# Altium project Lidar_PCB_Project.PrjPcb
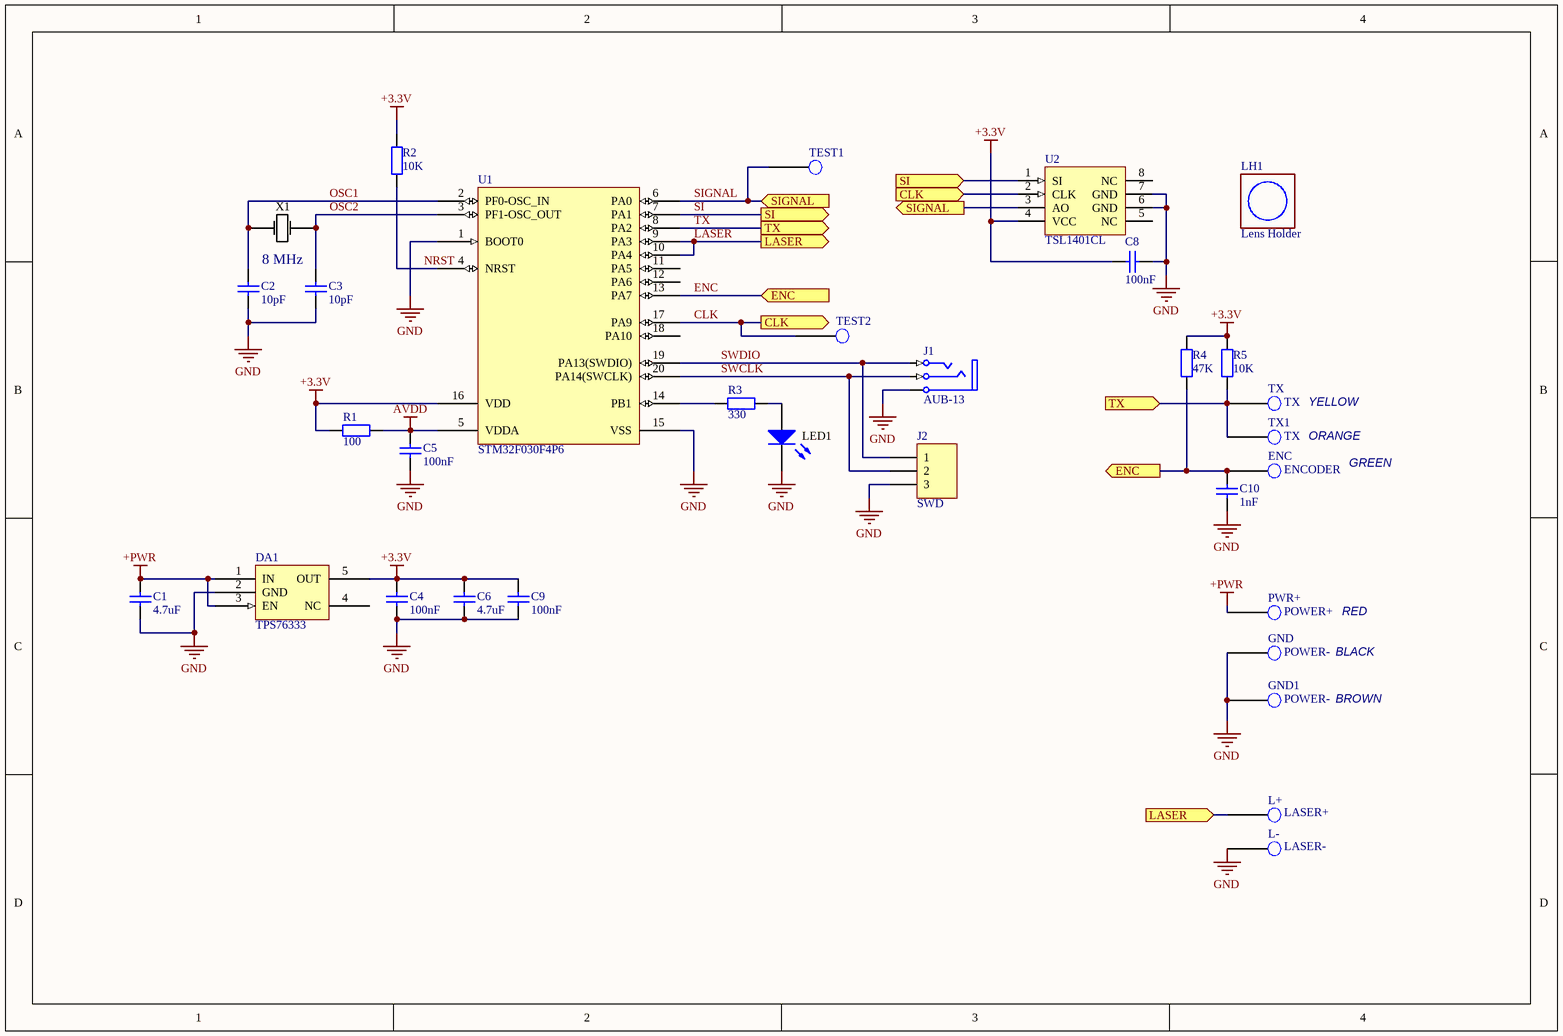
[diagram p0: lidar4_sch.SchDoc]
1 sheet, 32 parts. Net scope: flat (ports and power ports of the same name join across sheets).
Board file: PCB1.PcbDoc

## Sheet lidar4_sch.SchDoc
size A4; PageSetup: Record=PageOptions|CenterHorizontal=True|CenterVertical=True|PrintScale=1.00|XCorrection=1.00|YCorrection=1.00|PrintKind=0|BorderSize=5000000|LeftOffset=0|BottomOffset=0|Orientation=2|PaperLength=1000|PaperWidth=1000|Scale=100|PaperSource=7|PrintQuality=-3|MediaType=1|DitherType=10|PrintScaleMode=1|PaperKind=A4|PaperIndex=9

### Parts
C1  4.7uF  [CAPC2012X135N]
C2  10pF  [CAPC1608X90N]
C3  10pF  [CAPC1608X90N]
C4  100nF  [CAPC1608X90N]
C5  100nF  [CAPC1608X90N]
C6  4.7uF  [CAPC2012X135N]
C8  100nF  [CAPC1608X90N]
C9  100nF  [CAPC1608X90N]
C10  1nF  [CAPC1608X90N]
DA1  TPS76333  [SOT23-5]
ENC  ENCODER  [Ext_hole]
GND  POWER-  [Ext_hole]
GND1  POWER-  [Ext_hole]
J1  AUB-13  [AUB-13]
J2  SWD  [HDR1X3]
L+  LASER+  [Ext_hole]
L-  LASER-  [Ext_hole]
LED1  LED  [LED_0603]  (value not drawn)
LH1  Lens Holder  [LENS_HOLDER_2]
PWR+  POWER+  [Ext_hole]
R1  100  [RESC1608X55N]
R2  10K  [RESC1608X55N]
R3  330  [RESC1608X55N]
R4  47K  [RESC1608X55N]
R5  10K  [RESC1608X55N]
TEST1  Pad  [Ext_pad]  (value not drawn)
TEST2  Pad  [Ext_pad]  (value not drawn)
TX  TX  [Ext_hole]
TX1  TX  [Ext_hole]
U1  STM32F030F4P6  [TSSOP65P640X120-20N]
U2  TSL1401CL  [TSL1401CL_2]
X1  value 8 MHz  [SX-6 QUARTZ]  (hidden comment: Quartz)

### Ports
CLK (in), CLK (out), ENC (in), ENC (out), LASER (in), LASER (out), SI (in), SI (out), SIGNAL (in), SIGNAL (out), TX (in), TX (out)

### Nets
+3.3V: C4.2 C6.2 C8.2 C9.2 DA1.5(OUT) R1.1 R2.1 R4.1 R5.1 U1.16(VDD) U2.4(VCC)
+PWR: C1.2 DA1.1(IN) DA1.3(EN) PWR+.1(Pad)
AVDD: C5.2 R1.2 U1.5(VDDA)
GND: C1.1 C2.1 C3.1 C4.1 C5.1 C6.1 C8.1 C9.1 C10.1 DA1.2(GND) GND.1(Pad) GND1.1(Pad) J1.5(S) J2.3 L-.1(Pad) LED1.2(K) U1.1(BOOT0) U1.15(VSS) U2.6(GND) U2.7(GND)
CLK: TEST2.1(Pad) U1.17(PA9) U2.2(CLK) ; port CLK
ENC: C10.2 ENC.1(Pad) R4.2 U1.13(PA7) ; port ENC
LASER: L+.1(Pad) U1.9(PA3) U1.10(PA4) ; port LASER
NRST: R2.2 U1.4(NRST)
OSC1: C2.2 U1.2(PF0-OSC_IN) X1.1
OSC2: C3.2 U1.3(PF1-OSC_OUT) X1.3
SI: U1.7(PA1) U2.1(SI) ; port SI
SIGNAL: TEST1.1(Pad) U1.6(PA0) U2.3(AO) ; port SIGNAL
SWCLK: J1.3(R) J2.2 U1.20(PA14(SWCLK))
SWDIO: J1.1(T) J2.1 U1.19(PA13(SWDIO))
TX: R5.2 TX.1(Pad) TX1.1(Pad) U1.8(PA2) ; port TX
NetLED1_1: LED1.1(A) R3.1
NetR3_2: R3.2 U1.14(PB1)

Not connected (* = marked no-connect by the designer): DA1 4(NC); U1 11(PA5) 12(PA6) 18(PA10); U2 5(NC) 8(NC)

### Notes on the sheet
- YELLOW
- ORANGE
- GREEN
- BLACK
- RED
- BROWN

### Library data of the parts
C1-C6 C8-C10 = CC0805: Chip capacitor; Voltage: 25V; Series: X7R
  C1 C6: Value: 4.7uF
  C2 C3: Value: 10pF
  C4 C5 C8 C9: Value: 100nF
  C10: Value: 1nF
DA1 = TPS76333: LDO
ENC GND GND1 L+ L- PWR+ TEST1 TEST2 TX TX1 = Ext Pad: Pad for wire
J1 = Phonejack3: Jack Socket, 1/4" [6.5mm], Thru-Hole, Vertical, 3-Conductor Open Circuit (Non-Normalling); PackageDocument: 2003; PCB_Layout: Complies with manufacturer's recommendation.; DrillAndSlotSize: Corresponds to nominal value.; Published: 15-Jul-2004; LatestRevisionDate: 15-Jul-2004; LatestRevisionNote: Component Replaced.; DatasheetDocument: 2003; PackageReference: S1VS_SSS; Publisher: Altium Limited; ComponentLink1Description: Manufacturer Link; ComponentLink1URL: http://www.cliffuk.co.uk/
J2 = Header 3: Header, 3-Pin; LatestRevisionDate: 17-Jul-2002; LatestRevisionNote: Re-released for DXP Platform.; Publisher: Altium Limited
LED1 = LED_0603
LH1 = M12 Lens Holder
R1-R5 = RC0805: Chip resistor; Tolerance: 5%
  R1: Value: 100
  R2 R5: Value: 10K
  R3: Value: 330
  R4: Value: 47K
U1 = STM32F030F4P6: Value-line ARM-based 32-bit MCU with 16 to 64-KB Flash, timers,  ADC, communication interfaces, 2.4-3.6 V operation
U2 = TSL1401CL: Light sensor
X1 = Quartz_SX-6: Quartz_SX-6 (SMD06035C4)